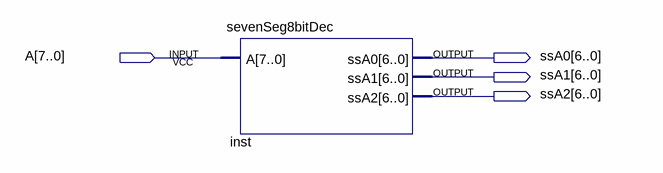
[diagram p0: schematic sheet]
// Quartus schematic testSevenSeg8BitDec.bdf as structural Verilog: 1 symbols, 4 pins
module testSevenSeg8BitDec (
  input  [7:0] A,
  output [6:0] ssA0,
  output [6:0] ssA1,
  output [6:0] ssA2
);

  sevenSeg8bitDec inst (.A(A), .ssA0(ssA0), .ssA1(ssA1), .ssA2(ssA2));
endmodule
